# Altium schematic sheet 7_UART&RS485.SchDoc: Apalis Evaluation Board 1.1
size A3; Organization: Toradex AG; Address1: Altsagenstrasse 5; Address2: Horw; Address3: 6048; Address4: Switzerland; DocumentNumber: 24; Revision: V1.1; SheetNumber: 24; SheetTotal: 32; PageSetup: Record=PageOptions|CenterHorizontal=True|CenterVertical=True|PrintScale=0.73|XCorrection=1.00|YCorrection=1.00|PrintKind=0|BorderSize=5000000|LeftOffset=0|BottomOffset=0|Orientation=2|PaperLength=1000|PaperWidth=1000|Scale=100|PaperSource=7|PrintQuality=-4|MediaType=1|DitherType=10|PaperKind=A4|PrintScaleMode=1
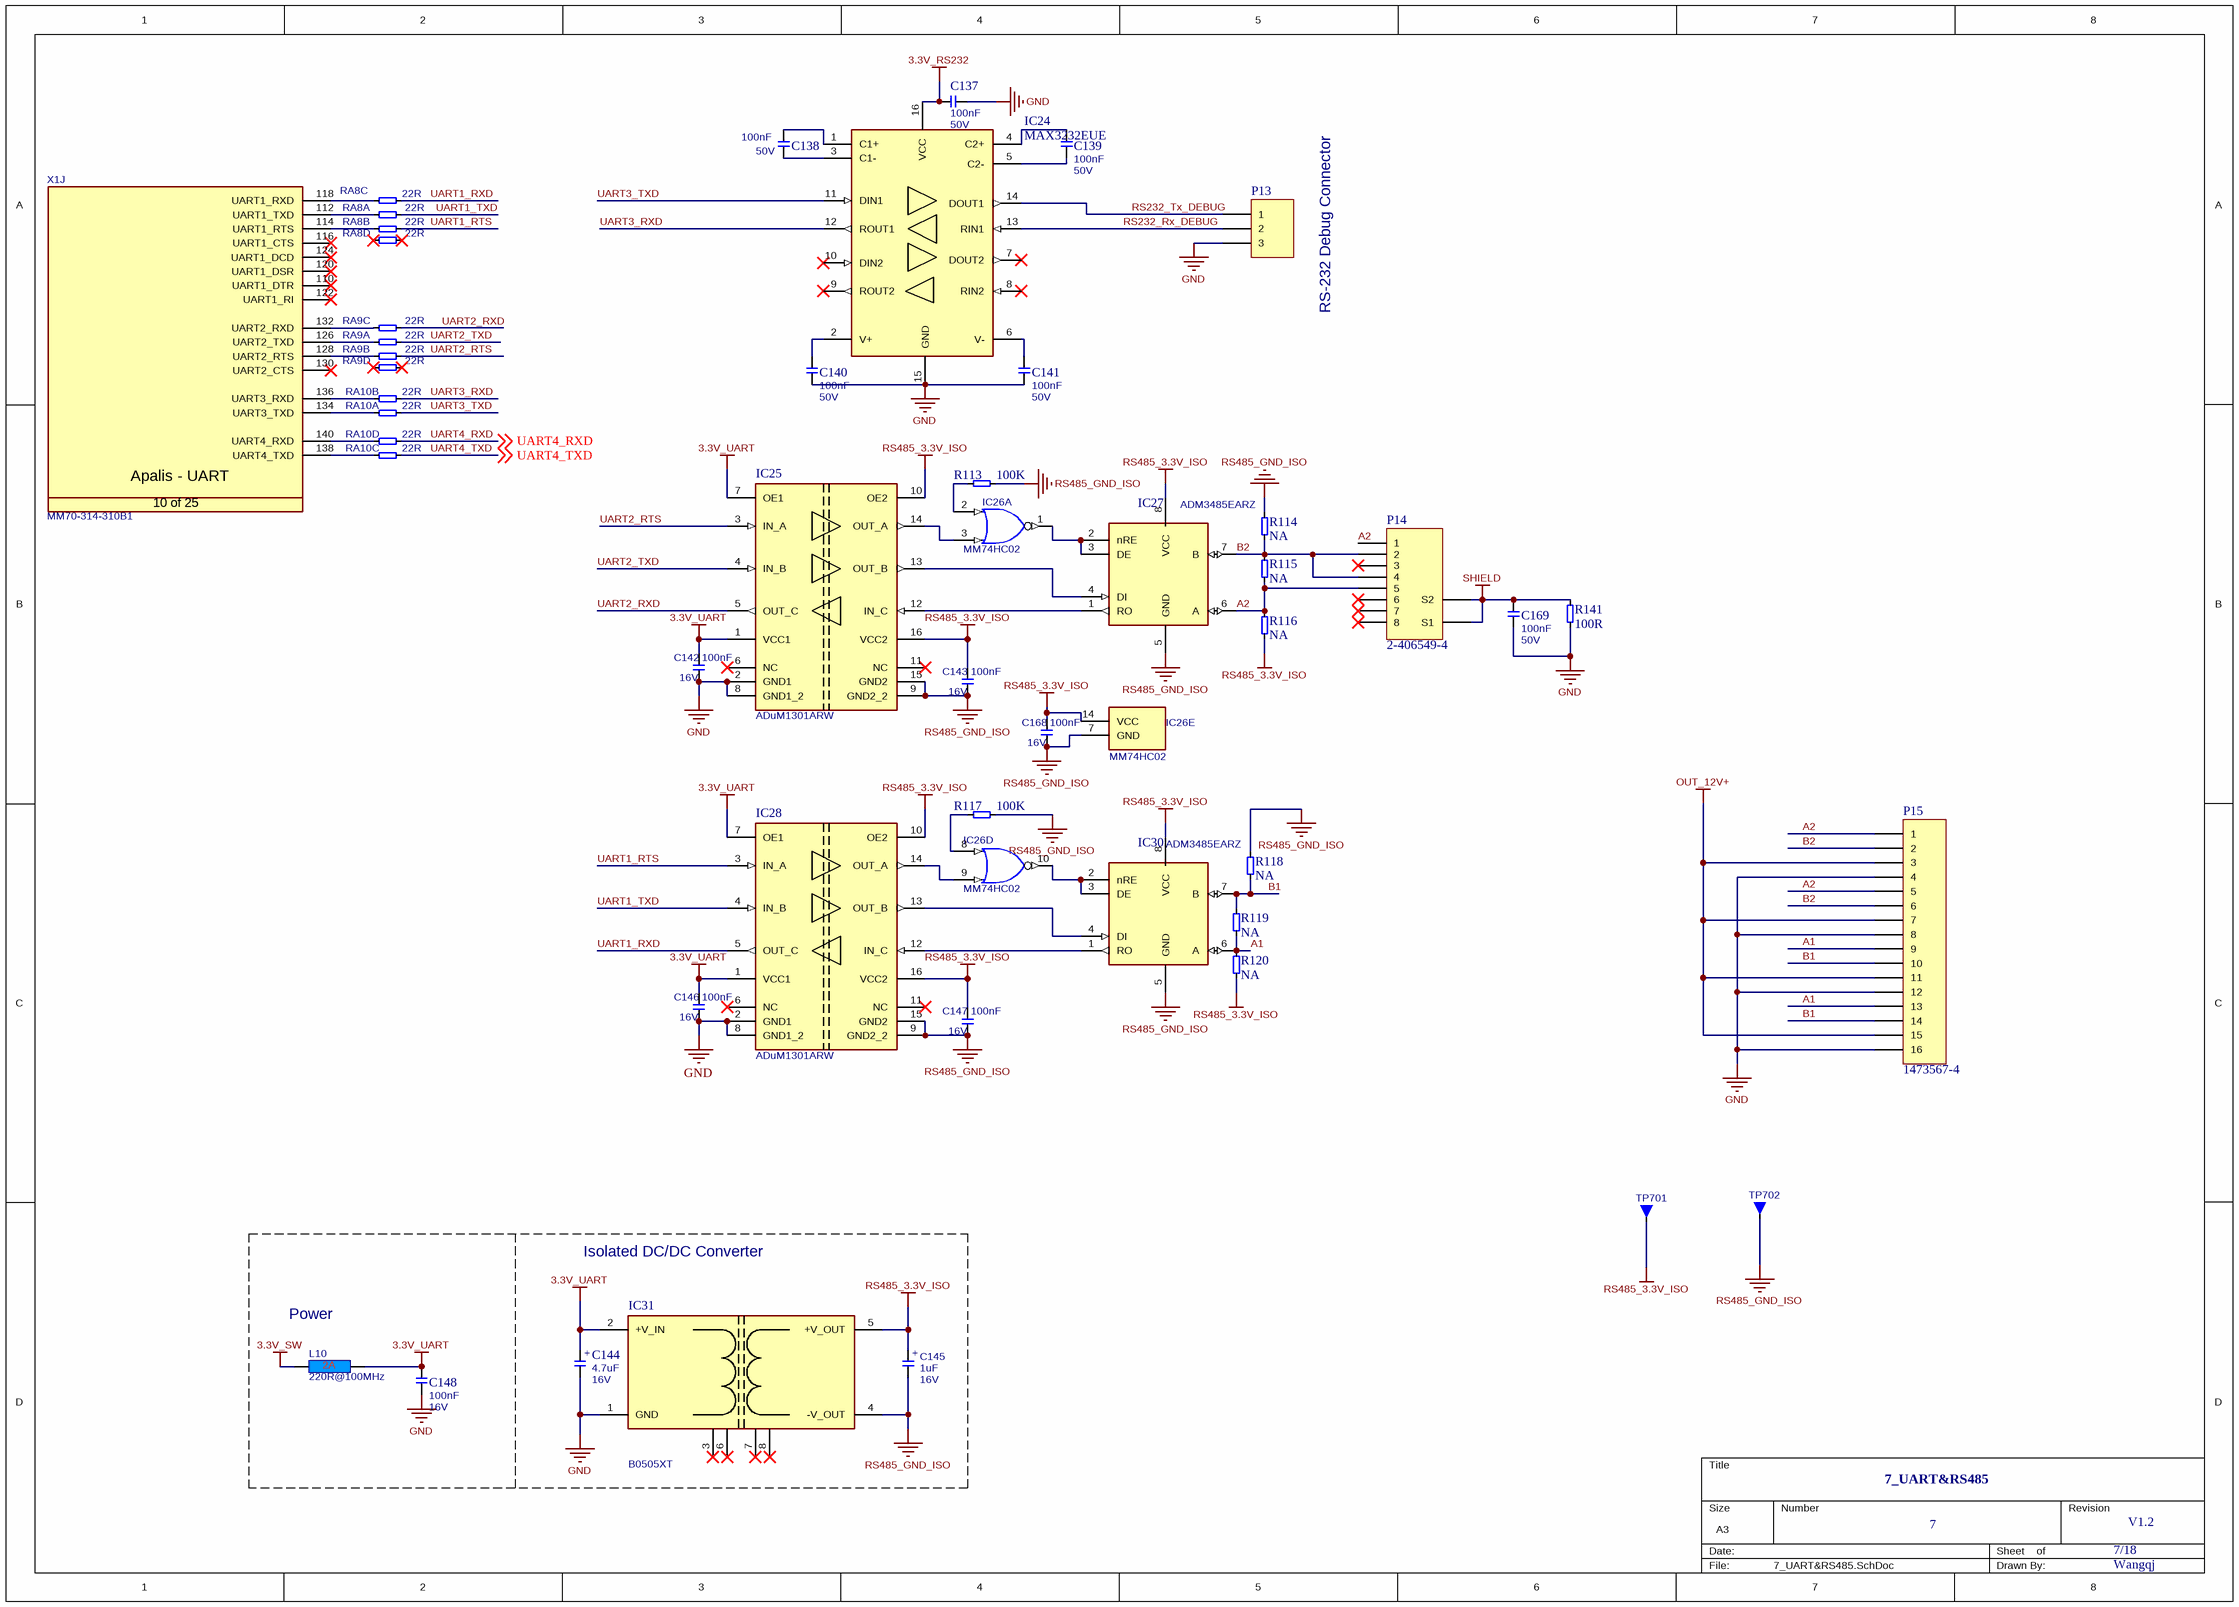
[diagram p0: 7_UART&RS485.SchDoc]

## Parts
C137  Rating: 50V  [T_CAPC0603X33N]  (hidden comment: 100nF)
C138  Rating: 50V  [T_CAPC0603X33N]  (hidden comment: 100nF)
C139  Rating: 50V  [T_CAPC0603X33N]  (hidden comment: 100nF)
C140  Rating: 50V  [T_CAPC0603X33N]  (hidden comment: 100nF)
C141  Rating: 50V  [T_CAPC0603X33N]  (hidden comment: 100nF)
C142  Rating: 16V  [T_CAPC0603X33N]  (hidden comment: 100nF)
C143  Rating: 16V  [T_CAPC0603X33N]  (hidden comment: 100nF)
C144  Rating: 16V  [T_CAPMP3216X180N]  (hidden comment: 4.7uF)
C145  Rating: 16V  [T_CAPMP3216X180N]  (hidden comment: 1uF)
C146  Rating: 16V  [T_CAPC0603X33N]  (hidden comment: 100nF)
C147  Rating: 16V  [T_CAPC0603X33N]  (hidden comment: 100nF)
C148  Rating: 16V  [T_CAPC0603X33N]  (hidden comment: 100nF)
C168  Rating: 16V  [T_CAPC0603X33N]  (hidden comment: 100nF)
C169  Rating: 50V  [T_CAPC0603X33N]  (hidden comment: 100nF)
IC24  MAX3232EUE  [LC-TSSOP-16]
IC25  ADuM1301ARW  [T_AD_ADuM1300ARW]
IC26  MM74HC02  [T_ST_M74HC02TTR]  (parts A,D,E of 5)
IC27  ADM3485EARZ  [LC-SOIC-8_150mil]
IC28  ADuM1301ARW  [T_AD_ADuM1300ARW]
IC30  ADM3485EARZ  [LC-SOIC-8_150mil]
IC31  Manufacturer Part No.: B0505XT  [MORNSUN_B0305XT-1W_SMD]  (hidden comment: B0505XT-1W)
L10  220R@100MHz  [INDC1608X95N]
P13  (no value)  [2.54*3P]
P14  2-406549-4  [RJ45卡口朝上]
P15  1473567-4  [147-4]
R113  100K  [T_RESC0603X30N]
R114  NA  [T_RESC0603X30N]
R115  NA  [T_RESC0603X30N]
R116  NA  [T_RESC0603X30N]
R117  100K  [T_RESC0603X30N]
R118  NA  [T_RESC0603X30N]
R119  NA  [T_RESC0603X30N]
R120  NA  [T_RESC0603X30N]
R141  100R  [T_RESC0603X30N]
RA8  22R  [T_Resistor_Array_X4]  (parts A,B,C,D of 4)
RA9  22R  [T_Resistor_Array_X4]  (parts A,B,C,D of 4)
RA10  22R  [T_Resistor_Array_X4]  (parts A,B,C,D of 4)
TP701  Testpin  [T_TP-THT]  (value not drawn)
TP702  Testpin  [T_TP-THT]  (value not drawn)
X1  Manufacturer Part No.: MM70-314-310B1  [T_JAE_MM70-314-310B1]  (hidden comment: CON-JAE-MM70-314-310B1-314-0.5mm)  (part J of 25)

## Nets
3.3V_RS232: C137.2 IC24.16(VCC)
3.3V_SW: L10.1
3.3V_UART: C142.2 C144.1 C146.2 C148.2 IC25.1(VCC1) IC25.7(OE1) IC28.1(VCC1) IC28.7(OE1) IC31.2(+V_IN) L10.2
GND: C137.1 C140.1 C141.1 C142.1 C144.2 C146.1 C148.1 C169.1 IC24.15(GND) IC25.2(GND1) IC25.8(GND1_2) IC28.2(GND1) IC28.8(GND1_2) IC31.1(GND) P13.3 P15.4 P15.8 P15.12 P15.16 R141.1
OUT_12V+: P15.3 P15.7 P15.11 P15.15
RS485_3.3V_ISO: C143.2 C145.1 C147.2 C168.2 IC25.10(OE2) IC25.16(VCC2) IC26.14(VCC) IC27.8(VCC) IC28.10(OE2) IC28.16(VCC2) IC30.8(VCC) IC31.5(+V_OUT) R116.1 R120.1 TP701.1
RS485_GND_ISO: C143.1 C145.2 C147.1 C168.1 IC25.9(GND2_2) IC25.15(GND2) IC26.7(GND) IC27.5(GND) IC28.9(GND2_2) IC28.15(GND2) IC30.5(GND) IC31.4(-V_OUT) R113.2 R114.2 R117.2 R118.2 TP702.1
SHIELD: C169.2 P14.S1 P14.S2 R141.2
A1: IC30.6(A) P15.9 P15.13 R119.1 R120.2
A2: IC27.6(A) P14.1 P14.5 P15.1 P15.5 R115.1 R116.2
B1: IC30.7(B) P15.10 P15.14 R118.1 R119.2
B2: IC27.7(B) P14.2 P14.4 P15.2 P15.6 R114.1 R115.2
RS232_Rx_DEBUG: IC24.13(RIN1) P13.2
RS232_Tx_DEBUG: IC24.14(DOUT1) P13.1
UART1_RTS: IC28.3(IN_A) RA8.6
UART1_RXD: IC28.5(OUT_C) RA8.7
UART1_TXD: IC28.4(IN_B) RA8.5
UART2_RTS: IC25.3(IN_A) RA9.6
UART2_RXD: IC25.5(OUT_C) RA9.7
UART2_TXD: IC25.4(IN_B) RA9.5
UART3_RXD: IC24.12(ROUT1) RA10.6
UART3_TXD: IC24.11(DIN1) RA10.5
UART4_RXD: RA10.8 ; off-sheet UART4_RXD
UART4_TXD: RA10.7 ; off-sheet UART4_TXD
NetC138_1: C138.1 IC24.3(C1-)
NetC138_2: C138.2 IC24.1(C1+)
NetC139_1: C139.1 IC24.5(C2-)
NetC139_2: C139.2 IC24.4(C2+)
NetC140_2: C140.2 IC24.2(V+)
NetC141_2: C141.2 IC24.6(V-)
NetIC25_12: IC25.12(IN_C) IC27.1(RO)
NetIC25_13: IC25.13(OUT_B) IC27.4(DI)
NetIC25_14: IC25.14(OUT_A) IC26.3(B)
NetIC26_1: IC26.1(~{O}) IC27.2(nRE) IC27.3(DE)
NetIC26_2: IC26.2(A) R113.1
NetIC26_8: IC26.8(A) R117.1
NetIC26_9: IC26.9(B) IC28.14(OUT_A)
NetIC26_10: IC26.10(~{O}) IC30.2(nRE) IC30.3(DE)
NetIC28_12: IC28.12(IN_C) IC30.1(RO)
NetIC28_13: IC28.13(OUT_B) IC30.4(DI)
NetRA8_1: RA8.1 X1.112(UART1_TXD)
NetRA8_2: RA8.2 X1.114(UART1_RTS)
NetRA8_3: RA8.3 X1.118(UART1_RXD)
NetRA9_1: RA9.1 X1.126(UART2_TXD)
NetRA9_2: RA9.2 X1.128(UART2_RTS)
NetRA9_3: RA9.3 X1.132(UART2_RXD)
NetRA10_1: RA10.1 X1.134(UART3_TXD)
NetRA10_2: RA10.2 X1.136(UART3_RXD)
NetRA10_3: RA10.3 X1.138(UART4_TXD)
NetRA10_4: RA10.4 X1.140(UART4_RXD)

Not connected (* = marked no-connect by the designer): IC24 7(DOUT2)* 8(RIN2)* 9(ROUT2)* 10(DIN2)*; IC25 6(NC)* 11(NC)*; IC28 6(NC)* 11(NC)*; IC31 3(NC)* 6(NC)* 7(NC)* 8(NC)*; P14 3* 6* 7* 8*; RA8 4* 8*; RA9 4* 8*; X1 110(UART1_DTR)* 116(UART1_CTS)* 120(UART1_DSR)* 122(UART1_RI)* 124(UART1_DCD)* 130(UART2_CTS)*

## Notes on the sheet
- RS-232 Debug Connector
- Isolated DC/DC Converter
- (near L10) Power
- 7_UART&RS485
- 7
- 7/18
- V1.2
- Wangqj
- Title
- Size:
- Date:
- A3
- Number:
- Time:
- Revision:
- Sheet
- of
- File:
- (in symbol C-1uF-16V-10%-3216-TA) +
- (in symbol C-4.7uF-16V-10%-3216-TA) +
- (in symbol CON-JAE-MM70-314-310B1-314-0.5mm, part J) Apalis - UART; 10 of 25

## Library data of the parts
C137-C141 = C-X7R-100nF-50V-20%-0603: Capacitor Ceramic X7R 100nF 50V 20% 0603; Tolerance: 20%; Type: X7R; Value: 100nF
C142 C143 C146 C147 C168 = C-X7R-100nF-16V-10%-0603: Capacitor Ceramic X7R 100nF 16V 10% 0603; Tolerance: 10%; Type: X7R; Value: 100nF
C144 = C-4.7uF-16V-10%-3216-TA: Capacitor TA 4.7uF 16V 10% 3216; Tolerance: 10%; Type: TA; Value: 4.7uF
C145 = C-1uF-16V-10%-3216-TA: Capacitor TA 1uF 16V 10% 3216; Tolerance: 10%; Type: TA; Value: 1uF
C148 = C-100nF-16V-10%-0603-X7R: Capacitor Ceramic X7R 100nF 16V 10% 0603; Tolerance: 10%; Type: X7R; Value: 100nF
C169 = C-100nF-50V-20%-0603-X7R: Capacitor Ceramic X7R 100nF 50V 20% 0603; Tolerance: 20%; Type: X7R; Value: 100nF
IC24 = IC-MAXIM-MAX3232: RS232
IC25 IC28 = IC-AD-ADuM1301ARW: Digital Isolator; Manufacturer Name: Analog Devices; Manufacturer Part No.: ADuM1301ARW
IC26 = IC-ST-M74HC02TTR: Quad 2-Input NOR Gate; Manufacturer Name: ON Semiconductor; Manufacturer part No.: MM74HC02
IC27 IC30 = IC-AD-ADM3485EARZ: ADM3485EARZ RS-485/RS-422 transceiver; Manufacturer Name: Analog Devices; Manufacturer Part No.: ADM3485EARZ
IC31 = IC-MORNSUN-B0505XT-SMD: MORNSUN Isolated DC/DC Converter; Manufacturer Name: Murata
L10 = L-220R@100MHz-2A-25%-0603: 220R@100MHz 2A EMI FILTER; Tolerance: 25%; Rating: 2A; Value: 220R@100MHz
P13 = Header 3: Header, 3-Pin; LatestRevisionDate: 17-Jul-2002; LatestRevisionNote: Re-released for DXP Platform.; Publisher: Altium Limited
P14 = CON-TECon-8Header: 网口
P15 = Header 16H: 泰科4p端子; LatestRevisionDate: 17-Jul-2002; LatestRevisionNote: Re-released for DXP Platform.; Publisher: Altium Limited
R113 R117 = R-100KR-63mW-5%-0603: Resistor 100 Kohm 63mW 5% 0603; Value: 100KR; Rating: 63mW; Tolerance: 5%
R114-R116 R118-R120 = R-NA-63mW-0603: Resistor NA 63mW  0603; Tolerance: 1%; Rating: 63mW; Value: NA
R141 = R-120R-63mW-5%-0603: Resistor 120 ohm 63mW 5% 0603; Rating: 63mW; Tolerance: 5%; Value: 100R
RA8-RA10 = RA-22R-63mW-5%-1206-div: Resistor Array 22 R 63mW 5% 1206; Tolerance: 5%; Power Dissipation: 63mW; Value: 22R
TP701 TP702 = Testpin: Testpin TH
X1 = CON-JAE-MM70-314-310B1-314-0.5mm: MXM3 Connector; Manufacturer Name: JAE; No. of ways: 314